# EasyEDA Pro project Project.epro, board TM171_adapter
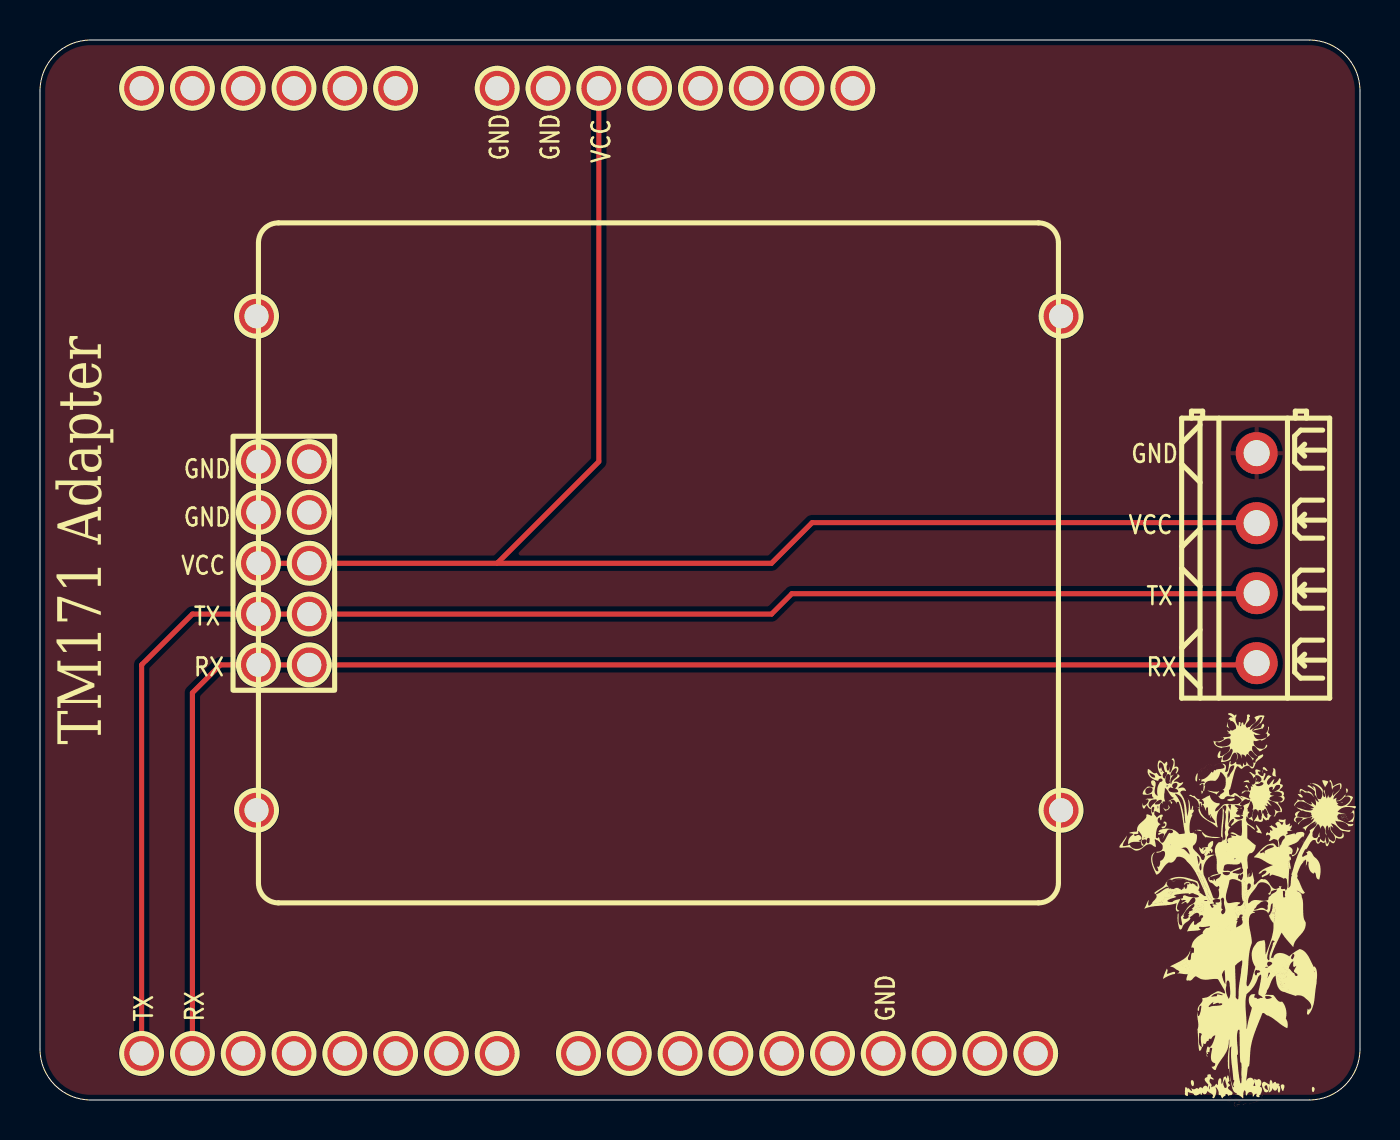
[diagram p4: board, top side]
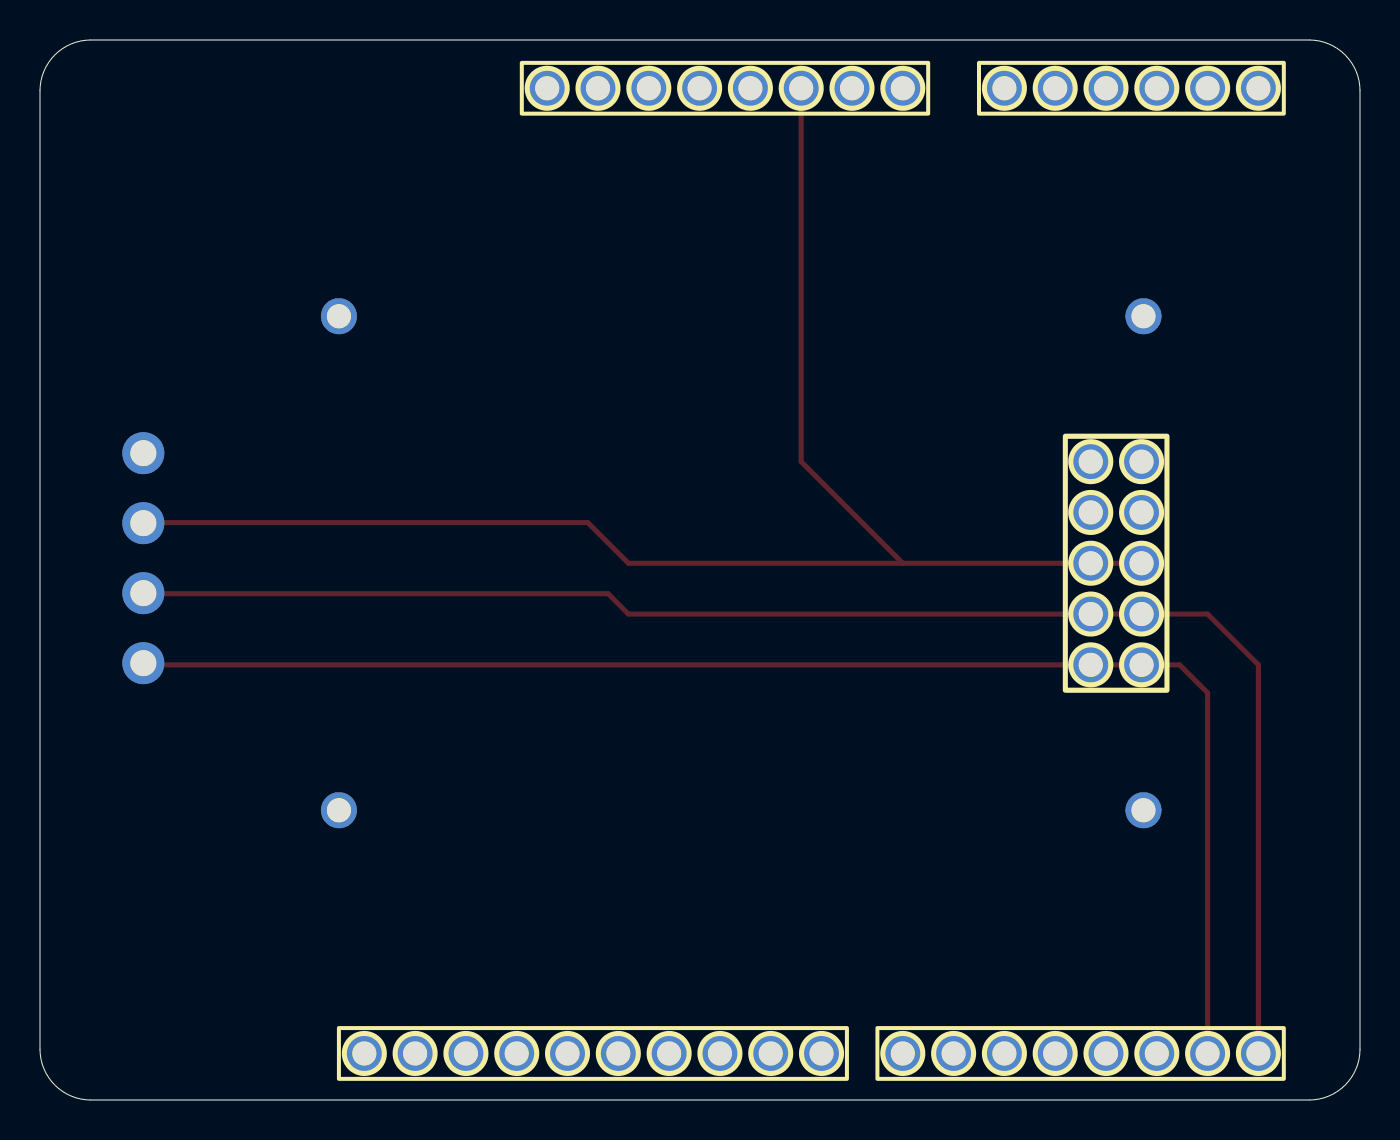
[diagram p5: board, bottom side, seen from below]

Outline 66 x 53 mm; copper layers: Top Layer, Bottom Layer. Coordinates in mm from the lower left corner of the outline.
Outline path: 0,50.46 0,2.54 arc(0.74,0.74) 2.54,0 63.46,0 arc(65.26,0.74) 66,2.54 66,50.46 arc(65.26,52.26) 63.46,53 2.54,53 arc(0.74,52.26) 0,50.46
Stack: Top Layer 0.035mm / Dielectric1 1.51mm FR4 er 4.5 / Bottom Layer 0.035mm

## Design rules (mm)
template: JLCPCB Capability(Two Layers Board)
spacing copperThickness1oz (default): track to track 0.102, other pairs 0.152 to 0.3
spacing copperThickness2oz: track to track 0.203, other pairs 0.152 to 0.3
track width copperThickness1oz (default): min 0.127, default 0.254, max 2.54
track width copperThickness2oz: min 0.203, default 0.254, max 2.54
differential pair differentialPair (default): width min 0.127, default 0.254, max 2.54; gap min 0.152, default 0.152
via viaSize (default): diameter min 0.5, default 0.61, max 10; hole min 0.3, default 0.305, max 6.3

## Placement (name value [footprint] x y rotation side)
NOREF  -  [Pad_e537]  38.1 50.59 90 top
NOREF#2  -  [Pad_e505]  10.16 2.33 90 top
NOREF#3  -  [Pad_e524]  20.32 2.33 90 top
NOREF#4  -  [Pad_e529]  27.94 50.59 90 top
NOREF#5  -  [Pad_e501]  5.08 2.33 90 top
NOREF#6  -  [Pad_e174]  10.83 39.19 90 top
NOREF#7  -  [Pad_e612]  10.92 29.38 0 top
NOREF#8  -  [Pad_e616]  10.92 21.76 0 top
NOREF#9  -  [Pad_e617]  13.46 29.38 0 top
NOREF#10  -  [Pad_e611]  10.92 31.92 0 top
NOREF#11  -  [Pad_e530]  29.46 2.33 90 top
NOREF#12  -  [Pad_e503]  7.62 2.33 90 top
NOREF#13  -  [Pad_e535]  35.56 50.59 90 top
NOREF#14  -  [Pad_e526]  22.86 50.59 90 top
NOREF#15  -  [Pad_e504]  10.16 50.59 90 top
NOREF#16  -  [Pad_e542]  47.24 2.33 90 top
NOREF#17  -  [Pad_e538]  39.62 2.33 90 top
NOREF#18  -  [Pad_e618]  13.46 26.84 0 top
NOREF#19  -  [Pad_e522]  17.78 50.59 90 top
NOREF#20  -  [Pad_e513]  12.7 2.33 90 top
NOREF#21  -  [Pad_e531]  30.48 50.59 90 top
NOREF#22  -  [Pad_e502]  7.62 50.59 90 top
NOREF#23  -  [Pad_e539]  40.64 50.59 90 top
NOREF#24  -  [Pad_e534]  34.54 2.33 90 top
NOREF#25  -  [Pad_e614]  10.92 24.3 0 top
NOREF#26  -  [Pad_e532]  32 2.33 90 top
NOREF#27  -  [Pad_e621]  13.46 31.92 0 top
NOREF#28  -  [Pad_e543]  49.78 2.33 90 top
NOREF#29  -  [Pad_e527]  25.4 50.59 90 top
NOREF#30  -  [Pad_e540]  42.16 2.33 90 top
NOREF#31  -  [Pad_e520]  15.24 50.59 90 top
NOREF#32  -  [Pad_e528]  26.92 2.33 90 top
NOREF#33  -  [Pad_e619]  13.46 24.3 0 top
NOREF#34  -  [Pad_e500]  5.08 50.59 90 top
NOREF#35  -  [Pad_e176]  10.83 14.49 90 top
NOREF#36  -  [Pad_e620]  13.46 21.76 0 top
NOREF#37  -  [Pad_e525]  22.86 2.33 90 top
NOREF#38  -  [Pad_e180]  51.05 14.49 90 top
NOREF#39  -  [Pad_e613]  10.92 26.84 0 top
NOREF#40  -  [Pad_e521]  15.24 2.33 90 top
NOREF#41  -  [Pad_e536]  37.08 2.33 90 top
NOREF#42  -  [Pad_e523]  17.78 2.33 90 top
NOREF#43  -  [Pad_e533]  33.02 50.59 90 top
NOREF#44  -  [Pad_e512]  12.7 50.59 90 top
NOREF#45  -  [Pad_e178]  51.05 39.19 90 top
NOREF#46  -  [Pad_e541]  44.7 2.33 90 top
U1  DB125-3.5-4P-GN-S  [CONN-TH_DB125-3.5-4P-GN]  60.83 27.09 90 top

## Footprints (pads in the part's own frame, mm; a bottom-side part is the same pattern mirrored in y, then rotated)
CONN-TH_DB125-3.5-4P-GN
  round 2.1 hole 1.3: 1(-5.25,0) 2(-1.75,0) 3(1.75,0) 4(5.25,0)
Pad_e174
  round 1.8 hole 1.205x1.2: (0,0)
Pad_e176
  round 1.8 hole 1.205x1.2: (0,0)
Pad_e178
  round 1.8 hole 1.205x1.2: (0,0)
Pad_e180
  round 1.8 hole 1.205x1.2: (0,0)
Pad_e500
  round 1.8 hole 1.205x1.2: 19(0,0)
Pad_e501
  round 1.8 hole 1.205x1.2: 1(0,0)
Pad_e502
  round 1.8 hole 1.205x1.2: 20(0,0)
Pad_e503
  round 1.8 hole 1.205x1.2: 2(0,0)
Pad_e504
  round 1.8 hole 1.205x1.2: 21(0,0)
Pad_e505
  round 1.8 hole 1.205x1.2: 3(0,0)
Pad_e512
  round 1.8 hole 1.205x1.2: 22(0,0)
Pad_e513
  round 1.8 hole 1.205x1.2: 4(0,0)
Pad_e520
  round 1.8 hole 1.205x1.2: 23(0,0)
Pad_e521
  round 1.8 hole 1.205x1.2: 5(0,0)
Pad_e522
  round 1.8 hole 1.205x1.2: 24(0,0)
Pad_e523
  round 1.8 hole 1.205x1.2: 6(0,0)
Pad_e524
  round 1.8 hole 1.205x1.2: 7(0,0)
Pad_e525
  round 1.8 hole 1.205x1.2: 8(0,0)
Pad_e526
  round 1.8 hole 1.205x1.2: 25(0,0)
Pad_e527
  round 1.8 hole 1.205x1.2: 26(0,0)
Pad_e528
  round 1.8 hole 1.205x1.2: 9(0,0)
Pad_e529
  round 1.8 hole 1.205x1.2: 27(0,0)
Pad_e530
  round 1.8 hole 1.205x1.2: 10(0,0)
Pad_e531
  round 1.8 hole 1.205x1.2: 28(0,0)
Pad_e532
  round 1.8 hole 1.205x1.2: 11(0,0)
Pad_e533
  round 1.8 hole 1.205x1.2: 29(0,0)
Pad_e534
  round 1.8 hole 1.205x1.2: 12(0,0)
Pad_e535
  round 1.8 hole 1.205x1.2: 30(0,0)
Pad_e536
  round 1.8 hole 1.205x1.2: 13(0,0)
Pad_e537
  round 1.8 hole 1.205x1.2: 31(0,0)
Pad_e538
  round 1.8 hole 1.205x1.2: 14(0,0)
Pad_e539
  round 1.8 hole 1.205x1.2: 32(0,0)
Pad_e540
  round 1.8 hole 1.205x1.2: 15(0,0)
Pad_e541
  round 1.8 hole 1.205x1.2: 16(0,0)
Pad_e542
  round 1.8 hole 1.205x1.2: 17(0,0)
Pad_e543
  round 1.8 hole 1.205x1.2: 18(0,0)
Pad_e611
  round 1.8 hole 1.205x1.2: 33(0,0)
Pad_e612
  round 1.8 hole 1.205x1.2: 34(0,0)
Pad_e613
  round 1.8 hole 1.205x1.2: 35(0,0)
Pad_e614
  round 1.8 hole 1.205x1.2: 36(0,0)
Pad_e616
  round 1.8 hole 1.205x1.2: 37(0,0)
Pad_e617
  round 1.8 hole 1.205x1.2: 40(0,0)
Pad_e618
  round 1.8 hole 1.205x1.2: 41(0,0)
Pad_e619
  round 1.8 hole 1.205x1.2: 42(0,0)
Pad_e620
  round 1.8 hole 1.205x1.2: 43(0,0)
Pad_e621
  round 1.8 hole 1.205x1.2: 39(0,0)

## Nets
GND: NOREF#7.34 NOREF#9.40 NOREF#10.33 NOREF#14.25 NOREF#27.39 NOREF#29.26 NOREF#30.15 U1.4
VCC: NOREF#4.27 NOREF#18.41 NOREF#39.35 U1.3
RX: NOREF#8.37 NOREF#12.2 NOREF#36.43 U1.1
TX: NOREF#5.1 NOREF#25.36 NOREF#33.42 U1.2

Pads without a net: NOREF 31; NOREF#2 3; NOREF#3 7; NOREF#11 10; NOREF#13 30; NOREF#15 21; NOREF#16 17; NOREF#17 14; NOREF#19 24; NOREF#20 4; NOREF#21 28; NOREF#22 20; NOREF#23 32; NOREF#24 12; NOREF#26 11; NOREF#28 18; NOREF#31 23; NOREF#32 9; NOREF#34 19; NOREF#37 8; NOREF#40 5; NOREF#41 13; NOREF#42 6; NOREF#43 29; NOREF#44 22; NOREF#46 16

## Routing (per net, layer and track width the routed paths; a pad name or vN(x,y) marks a point on that pad's centre or on a via; arc(x,y) is an arc through that point)
VCC: length 76.6
  Top Layer w0.254: NOREF#4.27 27.94,31.92 22.86,26.84 ; 22.86,26.84 36.58,26.84 38.61,28.87 60.81,28.87 U1.3 ; 22.86,26.84 NOREF#18.41 NOREF#39.35
RX: length 71.9
  Top Layer w0.254: NOREF#12.2 7.62,20.36 9.02,21.76 NOREF#8.37 NOREF#36.43 60.75,21.76 U1.1
TX: length 76.7
  Top Layer w0.254: NOREF#5.1 5.08,21.76 7.62,24.3 NOREF#25.36 NOREF#33.42 36.58,24.3 37.59,25.31 60.81,25.31 U1.2

## Copper pours and planes (outline as drawn; the poured copper is in the pictures)
GND on Top Layer: 0,53 66,53 66,0 0,0

## Text on the board
Top Silkscreen Layer: VCC | GND | TX | RX | TM171 Adapter
